# Altium schematic sheet Sheet.SchDoc
size A; SheetNumber: 1; SheetTotal: 1
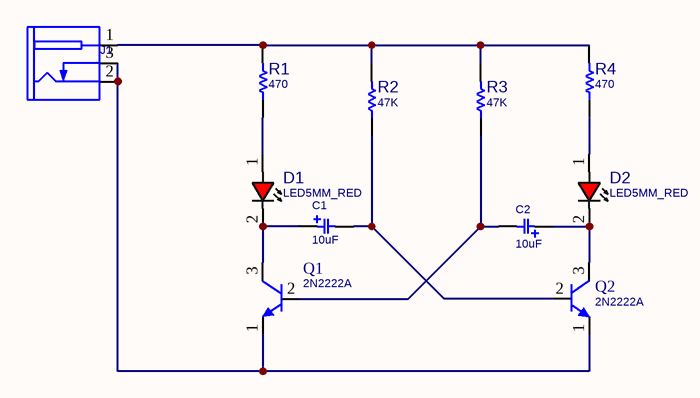
[diagram p0: Sheet.SchDoc]

## Parts
C1  10uF  [C_EL_4X7]
C2  10uF  [C_EL_4X7]
D1  LED5MM_RED  [LED5MM_RED]
D2  LED5MM_RED  [LED5MM_RED]
J1  DC_POWER_JACK  [JAC_PWR2]  (value not drawn)
Q1  2N2222A  [TO92_3]
Q2  2N2222A  [TO92_3]
R1  470  [R025W_AX04]
R2  47K  [R025W_AX04]
R3  47K  [R025W_AX04]
R4  470  [R025W_AX04]

## Nets
NetC1_1: C1.1 D1.2(CATHODE) Q1.3(C)
NetC1_2: C1.2 Q2.2(B) R2.1
NetC2_1: C2.1 D2.2(CATHODE) Q2.3(C)
NetC2_2: C2.2 Q1.2(B) R3.1
NetD1_1: D1.1(ANODE) R1.1
NetD2_1: D2.1(ANODE) R4.1
NetJ1_1: J1.1(TIP) R1.2 R2.2 R3.2 R4.2
NetJ1_2: J1.2(SLEEVE) J1.3(INSERTION_DET) Q1.1(E) Q2.1(E)

## Library data of the parts
C1 C2 = CAP_THD_EL_10u25V: CAP, THD, ELEC, 10uF, 25V; MANF_P#: MANF_PART#; PARAM: 25V; MANF: MANF; PARAM2: PARAM2; VALUE: 10uF
D1 D2 = LED_THD_5MM_RED: LED, THD, 5MM, RED; DESC: DESCRIPTION; MANF_P#: MANF_PART#; PARAM2: 2.2V; MANF: MANF; ASSEMBLY: ASSEMBLY; PRICE: PRICE; VALUE: LED5MM_RED
J1 = CONN_PWR_JACKR2: CONN, PWR JACK DC, PLUG DIAM 2.0MM RA THD; MANF: CUI STACK; MANF_P#: PJ-202A, PJ-002AH, PJ-102AH, KLDX-0202; VALUE: DC_POWER_JACK
Q1 Q2 = NPN_2N2222A_TO92: BJT, NPN, 40v, 0.6A, THD, TO92; PARAM: 0.6A, hFE100~300; PARAM2: 40v, 625mW; MANF: DIOTEC; MANF_P#: 2N2222A; VALUE: 2N2222A
R1-R4 = RES_THD: RESISTOR, THD; MANF_P#: RK73H1ETTP4701F; MANF: KOA SPEER; PARAM: 0.063W; DESC: DESCRIPTION; DIST#: MOUSER; PARAM2: 1%; ASSEMBLY: ASSEMBLY; PRICE: 100= 0.5$
  R1 R4: VALUE: 470
  R2 R3: VALUE: 47K